# EAGLE schematic xes_cabling (EAGLE 9.3.2)

## Sheet 1 of 2
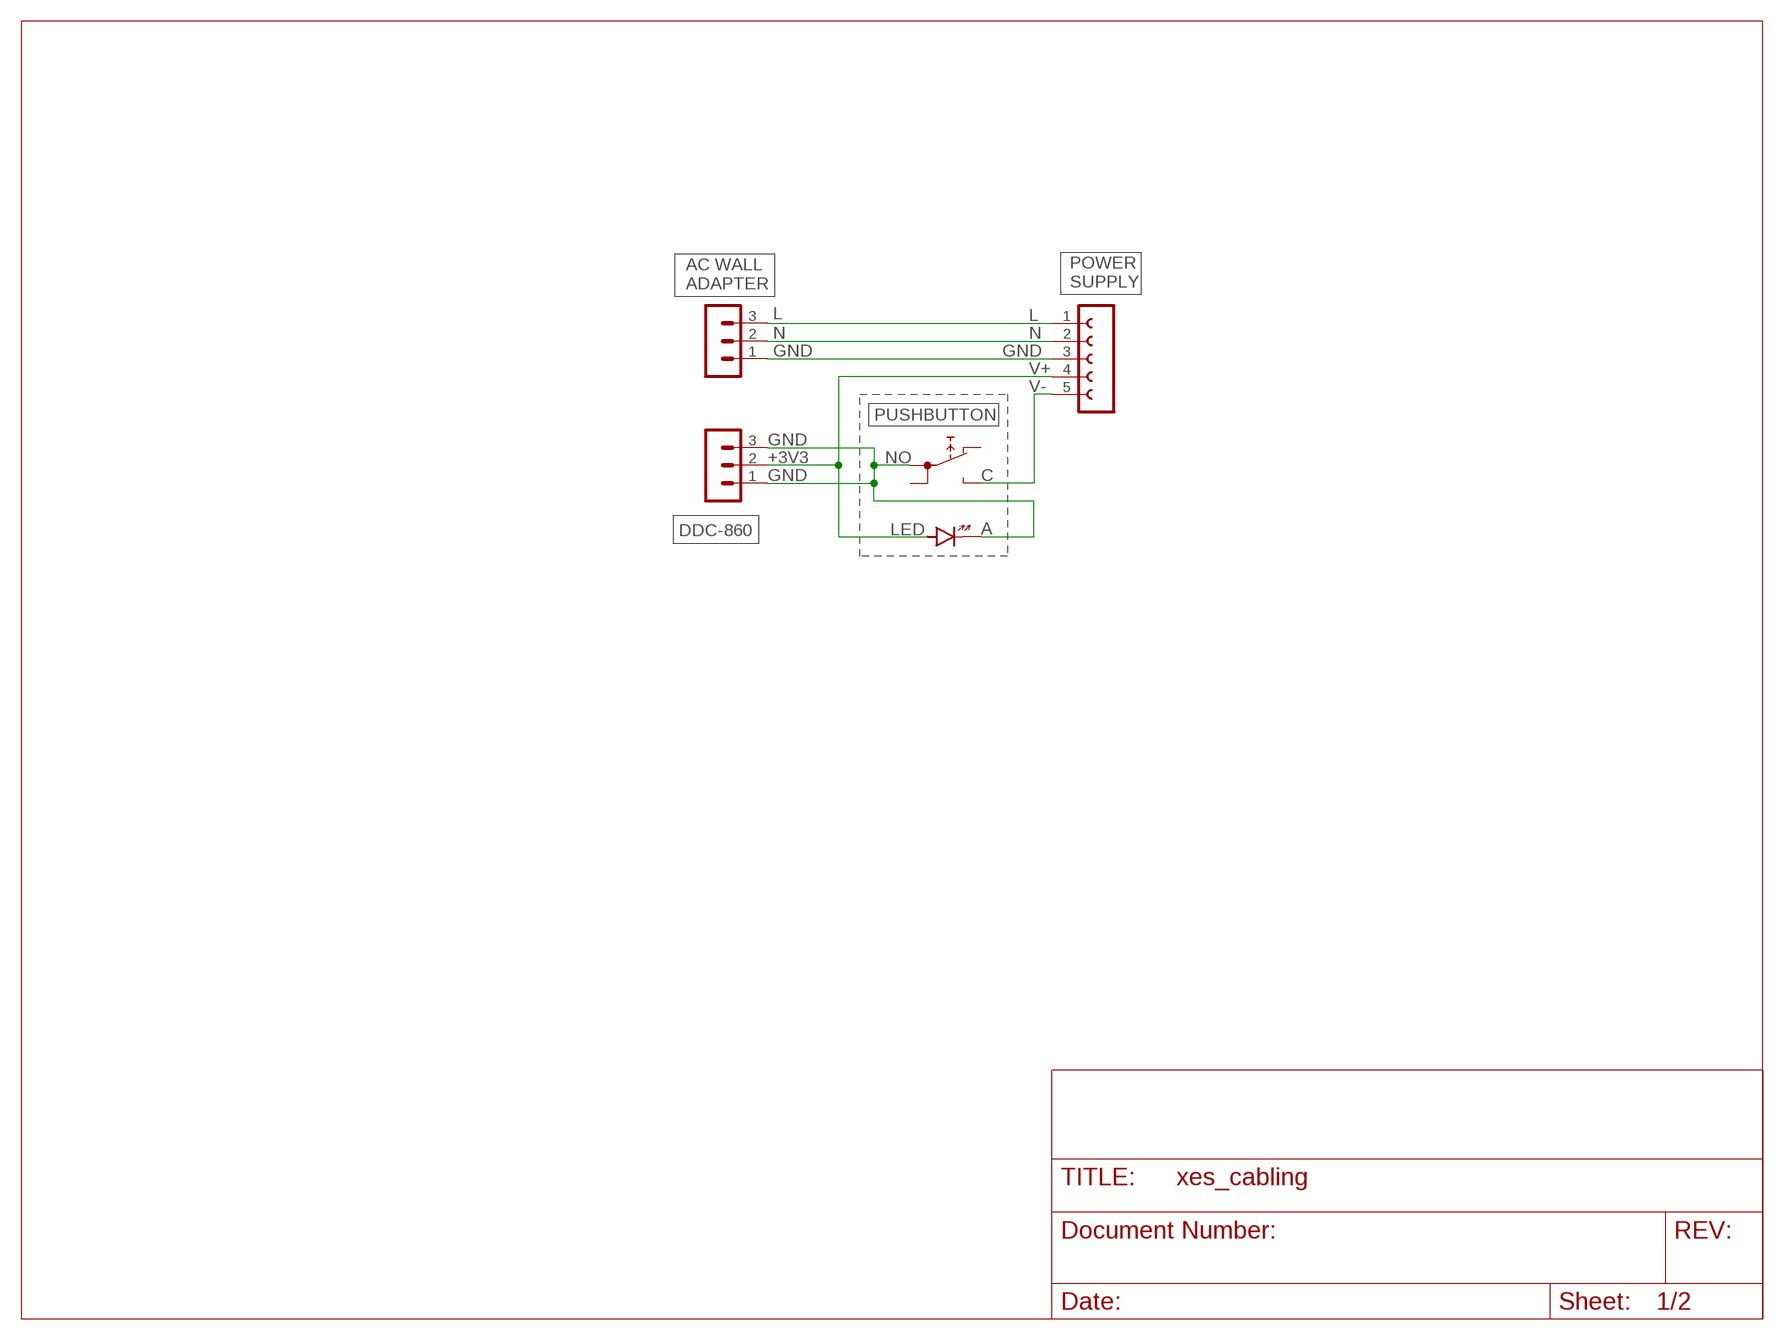
[diagram p0: schematic, sheet 1]

### Parts
LS25-3.3  PSU  FE05-1  [FE05-1]
S1  PUSHBUTTON  5501-1LED  [5501-1LED]
SV1  MA03-1  [MA03-1]
SV2  MA03-1  [MA03-1]

### Nets
C: LS25-3.3.5 S1.NO(-1:NO)
GND: LS25-3.3.3 S1.1A(-1:1A) S1.-(-LED:K) SV1.1 SV1.3 SV2.1
L: LS25-3.3.1 SV2.3
N: LS25-3.3.2 SV2.2
V+: LS25-3.3.4 S1.+(-LED:A) SV1.2
Unconnected: S1.1B(-1:1B) S1.NC(-1:NC)

### Notes on the sheet
- POWER
  SUPPLY
- AC WALL
  ADAPTER
- V-
- PUSHBUTTON
- +3V3 | NO
- DDC-860 | A
- LED

## Sheet 2 of 2
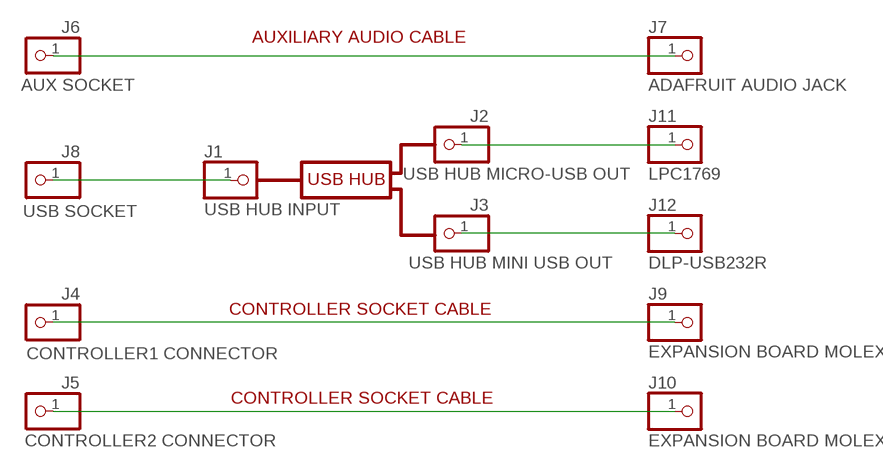
[diagram p1: schematic, sheet 2]

### Parts
J1  USB HUB INPUT  PINHD-1X1  [1X01]
J2  USB HUB MICRO-USB OUT  PINHD-1X1  [1X01]
J3  USB HUB MINI USB OUT  PINHD-1X1  [1X01]
J4  CONTROLLER1 CONNECTOR  PINHD-1X1  [1X01]
J5  CONTROLLER2 CONNECTOR  PINHD-1X1  [1X01]
J6  AUX SOCKET  PINHD-1X1  [1X01]
J7  ADAFRUIT AUDIO JACK  PINHD-1X1  [1X01]
J8  USB SOCKET  PINHD-1X1  [1X01]
J9  EXPANSION BOARD MOLEX1  PINHD-1X1  [1X01]
J10  EXPANSION BOARD MOLEX2  PINHD-1X1  [1X01]
J11  LPC1769  PINHD-1X1  [1X01]
J12  DLP-USB232R  PINHD-1X1  [1X01]

### Nets
N$1: J2.1 J11.1
N$2: J3.1 J12.1
N$3: J1.1 J8.1
N$4: J6.1 J7.1
N$5: J4.1 J9.1
N$6: J5.1 J10.1

### Notes on the sheet
- AUXILIARY AUDIO CABLE
- USB HUB
- CONTROLLER SOCKET CABLE
- CONTROLLER SOCKET CABLE

## Library data of the parts
J1-J12 = pinhead:PINHD-1X1: PIN HEADER
LS25-3.3 = con-lsta:FE05-1: FEMALE HEADER; OC_FARNELL: unknown; OC_NEWARK: unknown
S1 = switch:55?-1LED: PUSHBUTTON SERIES 5500 SWITCHES 1 LED Source: www.e-switch.com .. 5500.pdf
SV1 SV2 = con-lstb:MA03-1: PIN HEADER; OC_FARNELL: unknown; OC_NEWARK: unknown